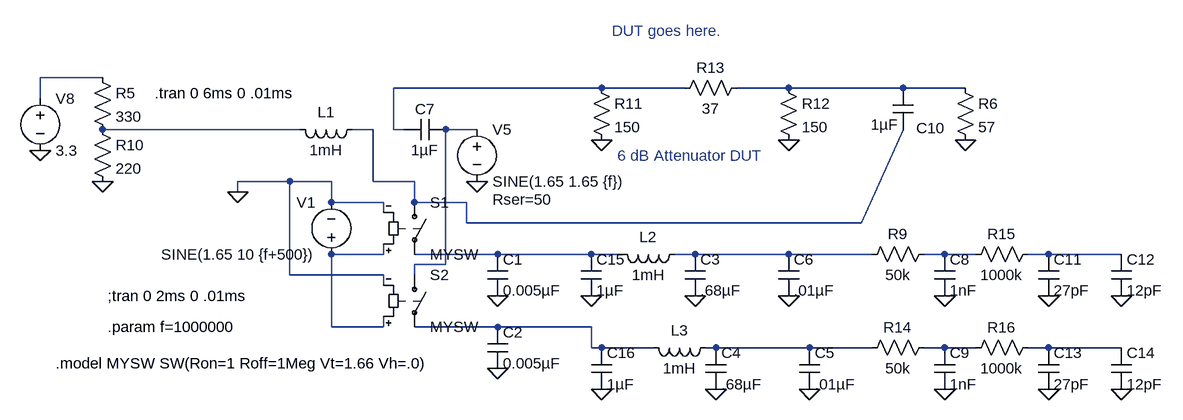
[diagram p0: schematic VNA2018NewInductLPF.asc]
VNA2018NewInductLPF.asc, the LTspice schematic file:
Version 4
SHEET 1 1236 888
WIRE -400 -96 -496 -96
WIRE 368 -80 48 -80
WIRE 496 -80 368 -80
WIRE 656 -80 576 -80
WIRE 832 -80 656 -80
WIRE 928 -80 832 -80
WIRE -496 -64 -496 -96
WIRE -96 -16 -400 -16
WIRE 16 -16 -16 -16
WIRE 48 -16 48 -80
WIRE 64 -16 48 -16
WIRE 176 -16 128 -16
WIRE -112 64 -192 64
WIRE -48 64 -112 64
WIRE 16 64 16 -16
WIRE 80 64 16 64
WIRE -192 80 -192 64
WIRE -48 96 -48 64
WIRE 32 96 -48 96
WIRE 80 96 80 64
WIRE 160 96 80 96
WIRE 32 112 32 96
WIRE 160 128 160 96
WIRE 768 128 832 -16
WIRE 768 128 160 128
WIRE 32 176 32 160
WIRE 32 176 -48 176
WIRE 208 176 80 176
WIRE 352 176 208 176
WIRE 400 176 352 176
WIRE 512 176 480 176
WIRE 656 176 512 176
WIRE 784 176 656 176
WIRE 896 176 864 176
WIRE 944 176 896 176
WIRE 1056 176 1024 176
WIRE 1168 176 1056 176
WIRE 128 192 128 -16
WIRE 128 192 80 192
WIRE -112 208 -112 64
WIRE 32 208 -112 208
WIRE 80 208 80 192
WIRE 32 224 32 208
WIRE -48 288 -48 176
WIRE 32 288 32 272
WIRE 32 288 -48 288
WIRE 208 288 80 288
WIRE 352 288 208 288
WIRE 352 320 352 288
WIRE 368 320 352 320
WIRE 448 320 368 320
WIRE 544 320 528 320
WIRE 688 320 544 320
WIRE 784 320 688 320
WIRE 896 320 864 320
WIRE 944 320 896 320
WIRE 1056 320 1024 320
WIRE 1168 320 1056 320
FLAG 208 352 0
FLAG 176 64 0
FLAG -192 80 0
FLAG -496 16 0
FLAG 208 240 0
FLAG -400 64 0
FLAG 656 0 0
FLAG 368 0 0
FLAG 928 0 0
FLAG 544 384 0
FLAG 688 384 0
FLAG 896 384 0
FLAG 1056 384 0
FLAG 1168 384 0
FLAG 1168 240 0
FLAG 1056 240 0
FLAG 896 240 0
FLAG 656 240 0
FLAG 512 240 0
FLAG 352 240 0
FLAG 368 384 0
SYMBOL sw 80 80 R0
SYMATTR InstName S1
SYMATTR Value MYSW
SYMBOL sw 80 192 R0
SYMATTR InstName S2
SYMATTR Value MYSW
SYMBOL voltage -48 192 R180
WINDOW 0 24 96 Left 2
WINDOW 3 24 16 Left 2
WINDOW 123 0 0 Left 2
WINDOW 39 0 0 Left 2
SYMATTR InstName V1
SYMATTR Value SINE(1.65 10 {f+500})
SYMBOL cap 192 176 R0
SYMATTR InstName C1
SYMATTR Value 0.005µF
SYMBOL cap 192 288 R0
SYMATTR InstName C2
SYMATTR Value 0.005µF
SYMBOL voltage 176 -32 R0
WINDOW 123 0 0 Left 2
WINDOW 39 24 124 Left 2
SYMATTR SpiceLine Rser=50
SYMATTR InstName V5
SYMATTR Value SINE(1.65 1.65 {f})
SYMBOL voltage -496 -80 R0
WINDOW 123 0 0 Left 2
WINDOW 39 0 0 Left 2
SYMATTR InstName V8
SYMATTR Value 3.3
SYMBOL res -416 -112 R0
SYMATTR InstName R5
SYMATTR Value 330
SYMBOL cap 128 -32 R90
WINDOW 0 0 32 VBottom 2
WINDOW 3 32 32 VTop 2
SYMATTR InstName C7
SYMATTR Value 1µF
SYMBOL ind 0 -32 R90
WINDOW 0 5 56 VBottom 2
WINDOW 3 32 56 VTop 2
SYMATTR InstName L1
SYMATTR Value 1mH
SYMATTR SpiceLine Ipk=0.43 Rser=2.58 Rpar=94200 Cpar=0
SYMBOL res -416 -32 R0
SYMATTR InstName R10
SYMATTR Value 220
SYMBOL res 352 -96 R0
SYMATTR InstName R11
SYMATTR Value 150
SYMBOL res 640 -96 R0
SYMATTR InstName R12
SYMATTR Value 150
SYMBOL res 592 -96 R90
WINDOW 0 0 56 VBottom 2
WINDOW 3 32 56 VTop 2
SYMATTR InstName R13
SYMATTR Value 37
SYMBOL cap 848 -16 R180
WINDOW 0 -49 2 Left 2
WINDOW 3 24 8 Left 2
SYMATTR InstName C10
SYMATTR Value 1µF
SYMBOL res 912 -96 R0
SYMATTR InstName R6
SYMATTR Value 57
SYMBOL cap 496 176 R0
SYMATTR InstName C3
SYMATTR Value .68µF
SYMBOL cap 528 320 R0
SYMATTR InstName C4
SYMATTR Value .68µF
SYMBOL cap 672 320 R0
SYMATTR InstName C5
SYMATTR Value .01µF
SYMBOL cap 640 176 R0
SYMATTR InstName C6
SYMATTR Value .01µF
SYMBOL cap 880 176 R0
SYMATTR InstName C8
SYMATTR Value 1nF
SYMBOL cap 880 320 R0
SYMATTR InstName C9
SYMATTR Value 1nF
SYMBOL cap 1040 176 R0
SYMATTR InstName C11
SYMATTR Value 27pF
SYMBOL cap 1152 176 R0
SYMATTR InstName C12
SYMATTR Value 12pF
SYMBOL cap 1040 320 R0
SYMATTR InstName C13
SYMATTR Value 27pF
SYMBOL cap 1152 320 R0
SYMATTR InstName C14
SYMATTR Value 12pF
SYMBOL res 880 160 R90
WINDOW 0 0 56 VBottom 2
WINDOW 3 32 56 VTop 2
SYMATTR InstName R9
SYMATTR Value 50k
SYMBOL res 880 304 R90
WINDOW 0 0 56 VBottom 2
WINDOW 3 32 56 VTop 2
SYMATTR InstName R14
SYMATTR Value 50k
SYMBOL res 1040 160 R90
WINDOW 0 0 56 VBottom 2
WINDOW 3 32 56 VTop 2
SYMATTR InstName R15
SYMATTR Value 1000k
SYMBOL res 1040 304 R90
WINDOW 0 0 56 VBottom 2
WINDOW 3 32 56 VTop 2
SYMATTR InstName R16
SYMATTR Value 1000k
SYMBOL ind 496 160 R90
WINDOW 0 5 56 VBottom 2
WINDOW 3 32 56 VTop 2
SYMATTR InstName L2
SYMATTR Value 1mH
SYMATTR SpiceLine Rser=25
SYMBOL ind 544 304 R90
WINDOW 0 5 56 VBottom 2
WINDOW 3 32 56 VTop 2
SYMATTR InstName L3
SYMATTR Value 1mH
SYMATTR SpiceLine Rser=25
SYMBOL cap 336 176 R0
SYMATTR InstName C15
SYMATTR Value 1µF
SYMBOL cap 352 320 R0
SYMATTR InstName C16
SYMATTR Value 1µF
TEXT -320 -72 Left 2 !.tran 0 6ms 0 .01ms
TEXT -392 240 Left 2 !;tran 0 2ms 0 .01ms
TEXT 384 -168 Left 2 ;DUT goes here.
TEXT -392 288 Left 2 !.param f=1000000
TEXT -472 344 Left 2 !.model MYSW SW(Ron=1 Roff=1Meg Vt=1.66 Vh=.0)
TEXT 392 24 Left 2 ;6 dB Attenuator DUT

The netlist it stands for:
* VNA2018NewInductLPF.asc
S1 N005 N008 N007 0 MYSW
S2 N006 N012 N007 0 MYSW
V1 N007 0 SINE(1.65 10 {f+500})
C1 N008 0 0.005µF
C2 N012 0 0.005µF
V5 N006 0 SINE(1.65 1.65 {f}) Rser=50
V8 N001 0 3.3
R5 N001 N004 330
C7 N006 N002 1µF
L1 N005 N004 1mH Ipk=0.43 Rser=2.58 Rpar=94200 Cpar=0
R10 N004 0 220
R11 N002 0 150
R12 N003 0 150
R13 N003 N002 37
C10 N005 N003 1µF
R6 N003 0 57
C3 N009 0 .68µF
C4 N013 0 .68µF
C5 N013 0 .01µF
C6 N009 0 .01µF
C8 N010 0 1nF
C9 N014 0 1nF
C11 N011 0 27pF
C12 N011 0 12pF
C13 N015 0 27pF
C14 N015 0 12pF
R9 N010 N009 50k
R14 N014 N013 50k
R15 N011 N010 1000k
R16 N015 N014 1000k
L2 N009 N008 1mH Rser=25
L3 N013 N012 1mH Rser=25
C15 N008 0 1µF
C16 N012 0 1µF
.tran 0 6ms 0 .01ms
;tran 0 2ms 0 .01ms
* DUT goes here.
.param f=1000000
.model MYSW SW(Ron=1 Roff=1Meg Vt=1.66 Vh=.0)
* 6 dB Attenuator DUT
.backanno
.end